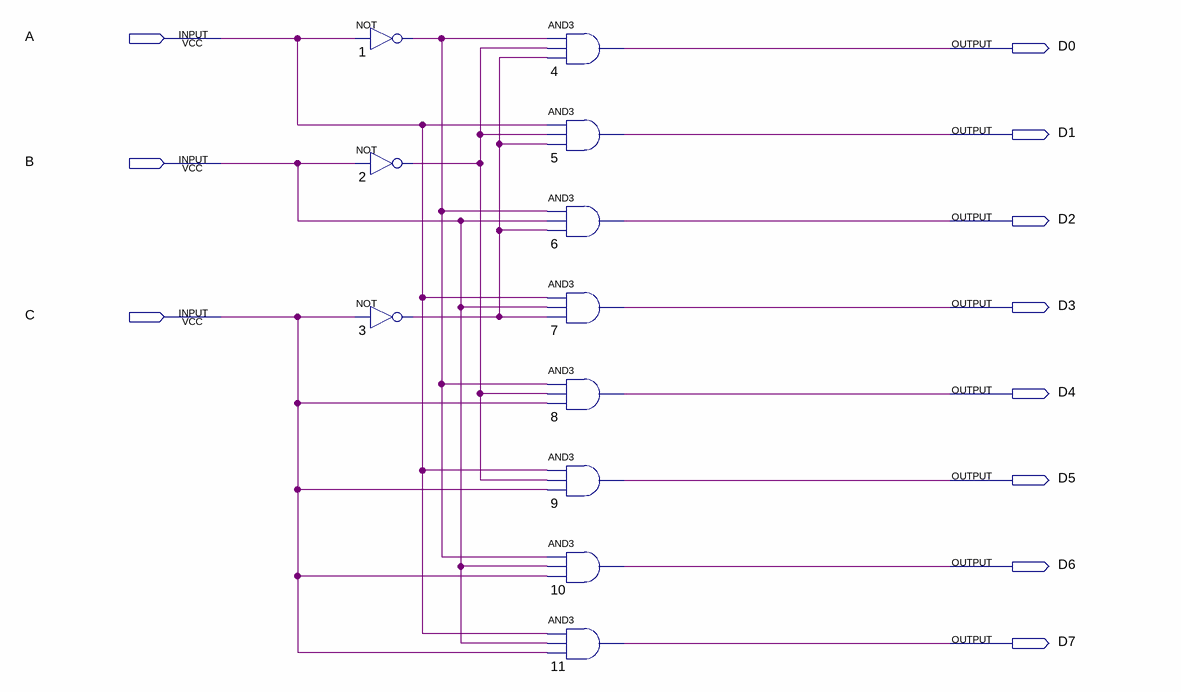
[diagram p0: schematic sheet]
// Quartus schematic 3-8_decoder.bdf as structural Verilog: 11 symbols, 11 pins
module \3-8_decoder  (
  input  A,
  input  B,
  input  C,
  output D0,
  output D1,
  output D2,
  output D3,
  output D4,
  output D5,
  output D6,
  output D7
);

  wire n1_out, n2_out, n3_out;

  not u_1 (n1_out, A);
  not u_2 (n2_out, B);
  not u_3 (n3_out, C);
  and u_4 (D0, n1_out, n2_out, n3_out);
  and u_5 (D1, A, n2_out, n3_out);
  and u_6 (D2, n1_out, B, n3_out);
  and u_7 (D3, A, B, n3_out);
  and u_8 (D4, n1_out, n2_out, C);
  and u_9 (D5, A, n2_out, C);
  and u_10 (D6, n1_out, B, C);
  and u_11 (D7, A, B, C);
endmodule
